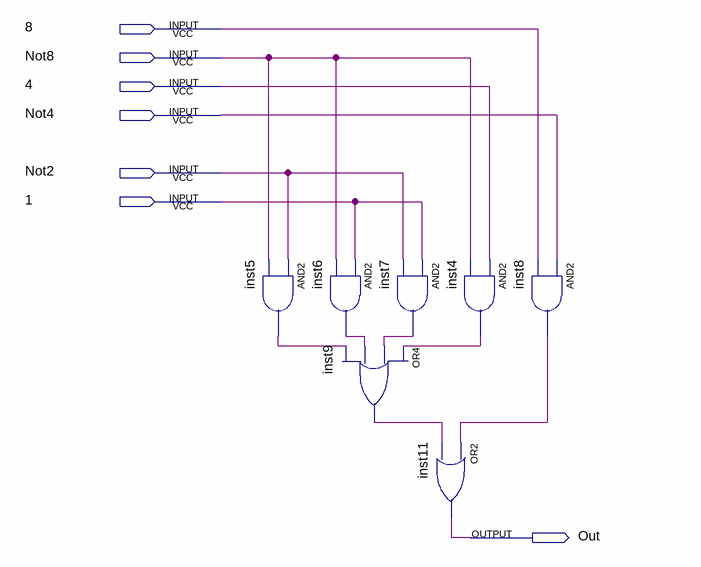
[diagram p0: schematic sheet]
// Quartus schematic C.bdf as structural Verilog: 7 symbols, 7 pins
module C (
  input  \8 ,
  input  Not8,
  input  \4 ,
  input  Not4,
  input  Not2,
  input  \1 ,
  output Out
);

  wire inst4_out, inst5_out, inst6_out, inst7_out, inst8_out, inst9_out;

  and inst5 (inst5_out, Not2, Not8);
  and inst6 (inst6_out, \1 , Not8);
  or inst9 (inst9_out, inst4_out, inst7_out, inst6_out, inst5_out);
  and inst7 (inst7_out, \1 , Not2);
  or inst11 (Out, inst8_out, inst9_out);
  and inst4 (inst4_out, \4 , Not8);
  and inst8 (inst8_out, Not4, \8 );
endmodule
